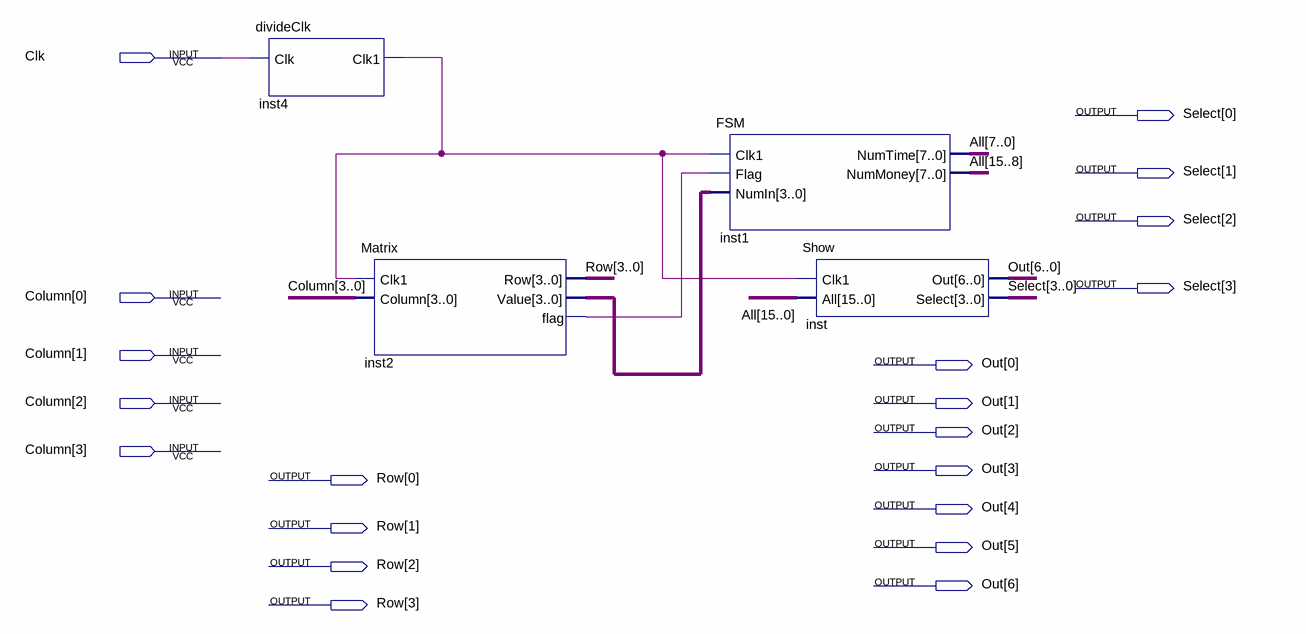
[diagram p0: schematic sheet]
// Quartus schematic all2.bdf as structural Verilog: 4 symbols, 20 pins
module all2 (
  input  Clk,
  input  [3:0] Column,
  output [3:0] Select,
  output [6:0] Out,
  output [3:0] Row
);

  wire inst2_flag, inst4_clk1;
  wire [3:0] inst2_value;
  wire [15:0] All;

  divideClk inst4 (.Clk(Clk), .Clk1(inst4_clk1));
  Matrix inst2 (.Clk1(inst4_clk1), .Column(Column), .Row(Row), .Value(inst2_value), .flag(inst2_flag));
  FSM inst1 (.Clk1(inst4_clk1), .Flag(inst2_flag), .NumIn(inst2_value), .NumTime(All[7:0]), .NumMoney(All[15:8]));
  Show inst (.Clk1(inst4_clk1), .All(All), .Out(Out), .Select(Select));
endmodule
